# EAGLE design final_board (EAGLE 5.11)

## Sheet 1 of 4
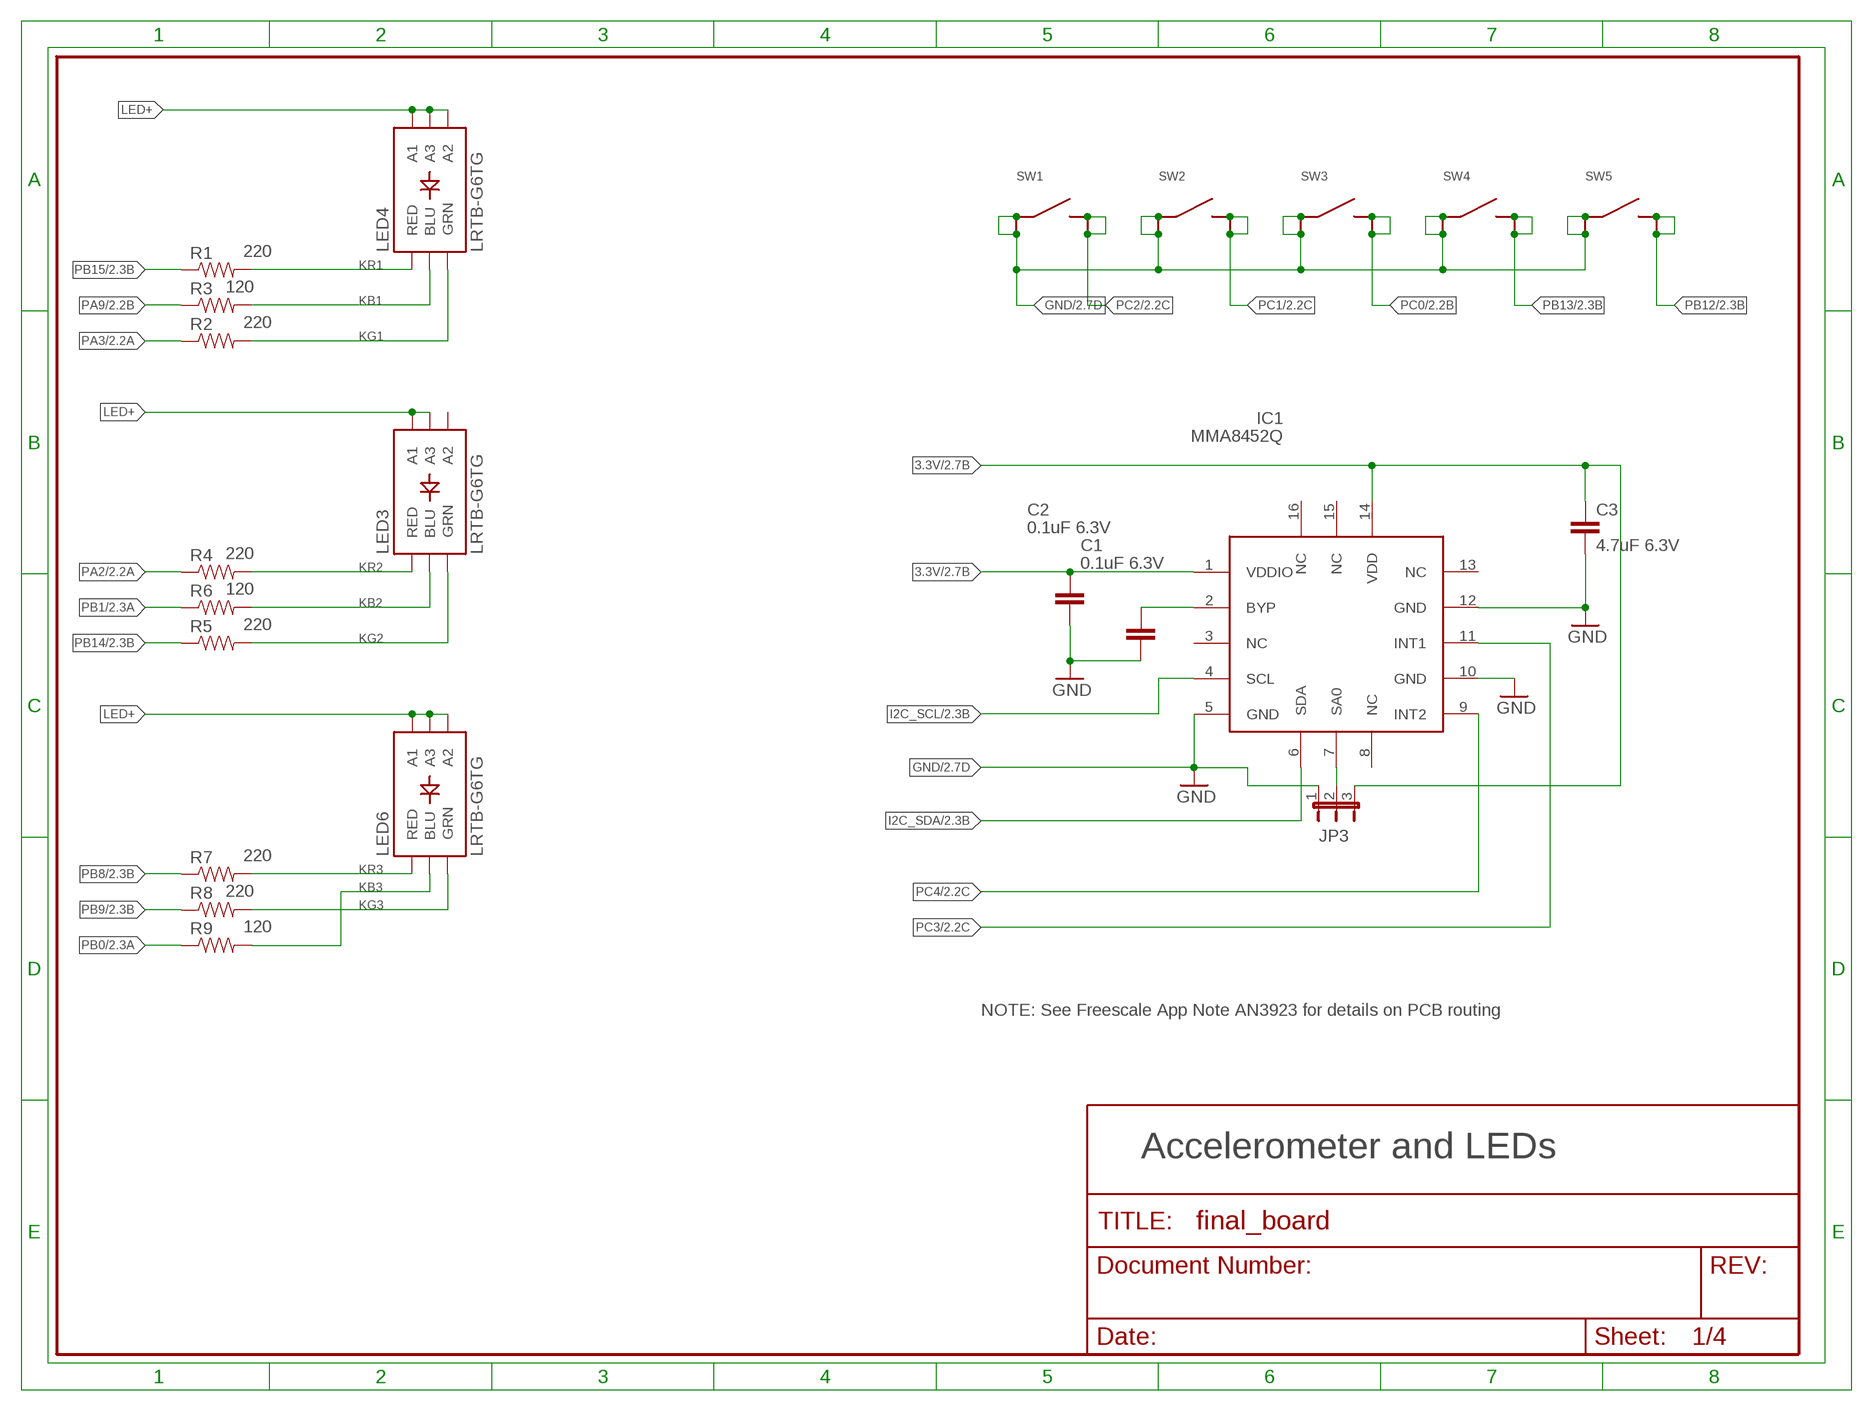
[diagram p0: schematic, sheet 1]

### Parts
C1  0.1uF 6.3V  C-EUC0603  [C0603]
C2  0.1uF 6.3V  C-EUC0603  [C0603]
C3  4.7uF 6.3V  C-EUC0603  [C0603]
IC1  MMA8452Q  [MMA8450Q]
JP3  JUMPER-3SMD  [SJ_3]
LED3  LRTB-G6TG  [LRTB-G6TG]
LED4  LRTB-G6TG  [LRTB-G6TG]
LED6  LRTB-G6TG  [LRTB-G6TG]
R1  220  RESISTOR0603-RES  [0603-RES]
R2  220  RESISTOR0603-RES  [0603-RES]
R3  120  RESISTOR0603-RES  [0603-RES]
R4  220  RESISTOR0603-RES  [0603-RES]
R5  220  RESISTOR0603-RES  [0603-RES]
R6  120  RESISTOR0603-RES  [0603-RES]
R7  220  RESISTOR0603-RES  [0603-RES]
R8  220  RESISTOR0603-RES  [0603-RES]
R9  120  RESISTOR0603-RES  [0603-RES]
SW1  D6_PB  [D6_BUTTON]
SW2  D6_PB  [D6_BUTTON]
SW3  D6_PB  [D6_BUTTON]
SW4  D6_PB  [D6_BUTTON]
SW5  D6_PB  [D6_BUTTON]

### Nets
3.3V: C2.1 C3.1 IC1.1(VDDIO) IC1.14(VDD) JP3.3 ; also sheet 2,3,4
GND: C1.2 C2.2 C3.2 IC1.5(GND) IC1.10(GND) IC1.12(GND) JP3.1 SW1.A1(A) SW1.A2(A1) SW2.A1(A) SW2.A2(A1) SW3.A1(A) SW3.A2(A1) SW4.A1(A) SW4.A2(A1) SW5.A1(A) SW5.A2(A1) ; also sheet 2,3,4
I2C_SCL: IC1.4(SCL) ; also sheet 2
I2C_SDA: IC1.6(SDA) ; also sheet 2
KB1 [LED]: LED4.C3(BLU) R3.2
KB2 [LED]: LED3.C3(BLU) R6.2
KB3 [LED]: LED6.C3(BLU) R9.2
KG1 [LED]: LED4.C2(GRN) R2.2
KG2 [LED]: LED3.C2(GRN) R5.2
KG3 [LED]: LED6.C2(GRN) R8.2
KR1 [LED]: LED4.C1(RED) R1.2
KR2 [LED]: LED3.C1(RED) R4.2
KR3 [LED]: LED6.C1(RED) R7.2
LED+ [LED]: LED3.A1 LED3.A3 LED4.A1 LED4.A2 LED4.A3 LED6.A1 LED6.A2 LED6.A3
N$2: IC1.7(SA0) JP3.2
N$4: C1.1 IC1.2(BYP)
PA2: R4.1 ; also sheet 2
PA3: R2.1 ; also sheet 2
PA9: R3.1 ; also sheet 2
PB0: R9.1 ; also sheet 2
PB1: R6.1 ; also sheet 2
PB8: R7.1 ; also sheet 2
PB9: R8.1 ; also sheet 2
PB12: SW5.B1(B) SW5.B2(B1) ; also sheet 2
PB13: SW4.B1(B) SW4.B2(B1) ; also sheet 2
PB14: R5.1 ; also sheet 2
PB15: R1.1 ; also sheet 2
PC0: SW3.B1(B) SW3.B2(B1) ; also sheet 2
PC1: SW2.B1(B) SW2.B2(B1) ; also sheet 2
PC2: SW1.B1(B) SW1.B2(B1) ; also sheet 2
PC3: IC1.11(INT1) ; also sheet 2
PC4: IC1.9(INT2) ; also sheet 2
Unconnected: IC1.3(NC) IC1.8(NC) IC1.13(NC) IC1.15(NC) IC1.16(NC) LED3.A2

### Notes on the sheet
- NOTE: See Freescale App Note AN3923 for details on PCB routing
- Accelerometer and LEDs

## Sheet 2 of 4
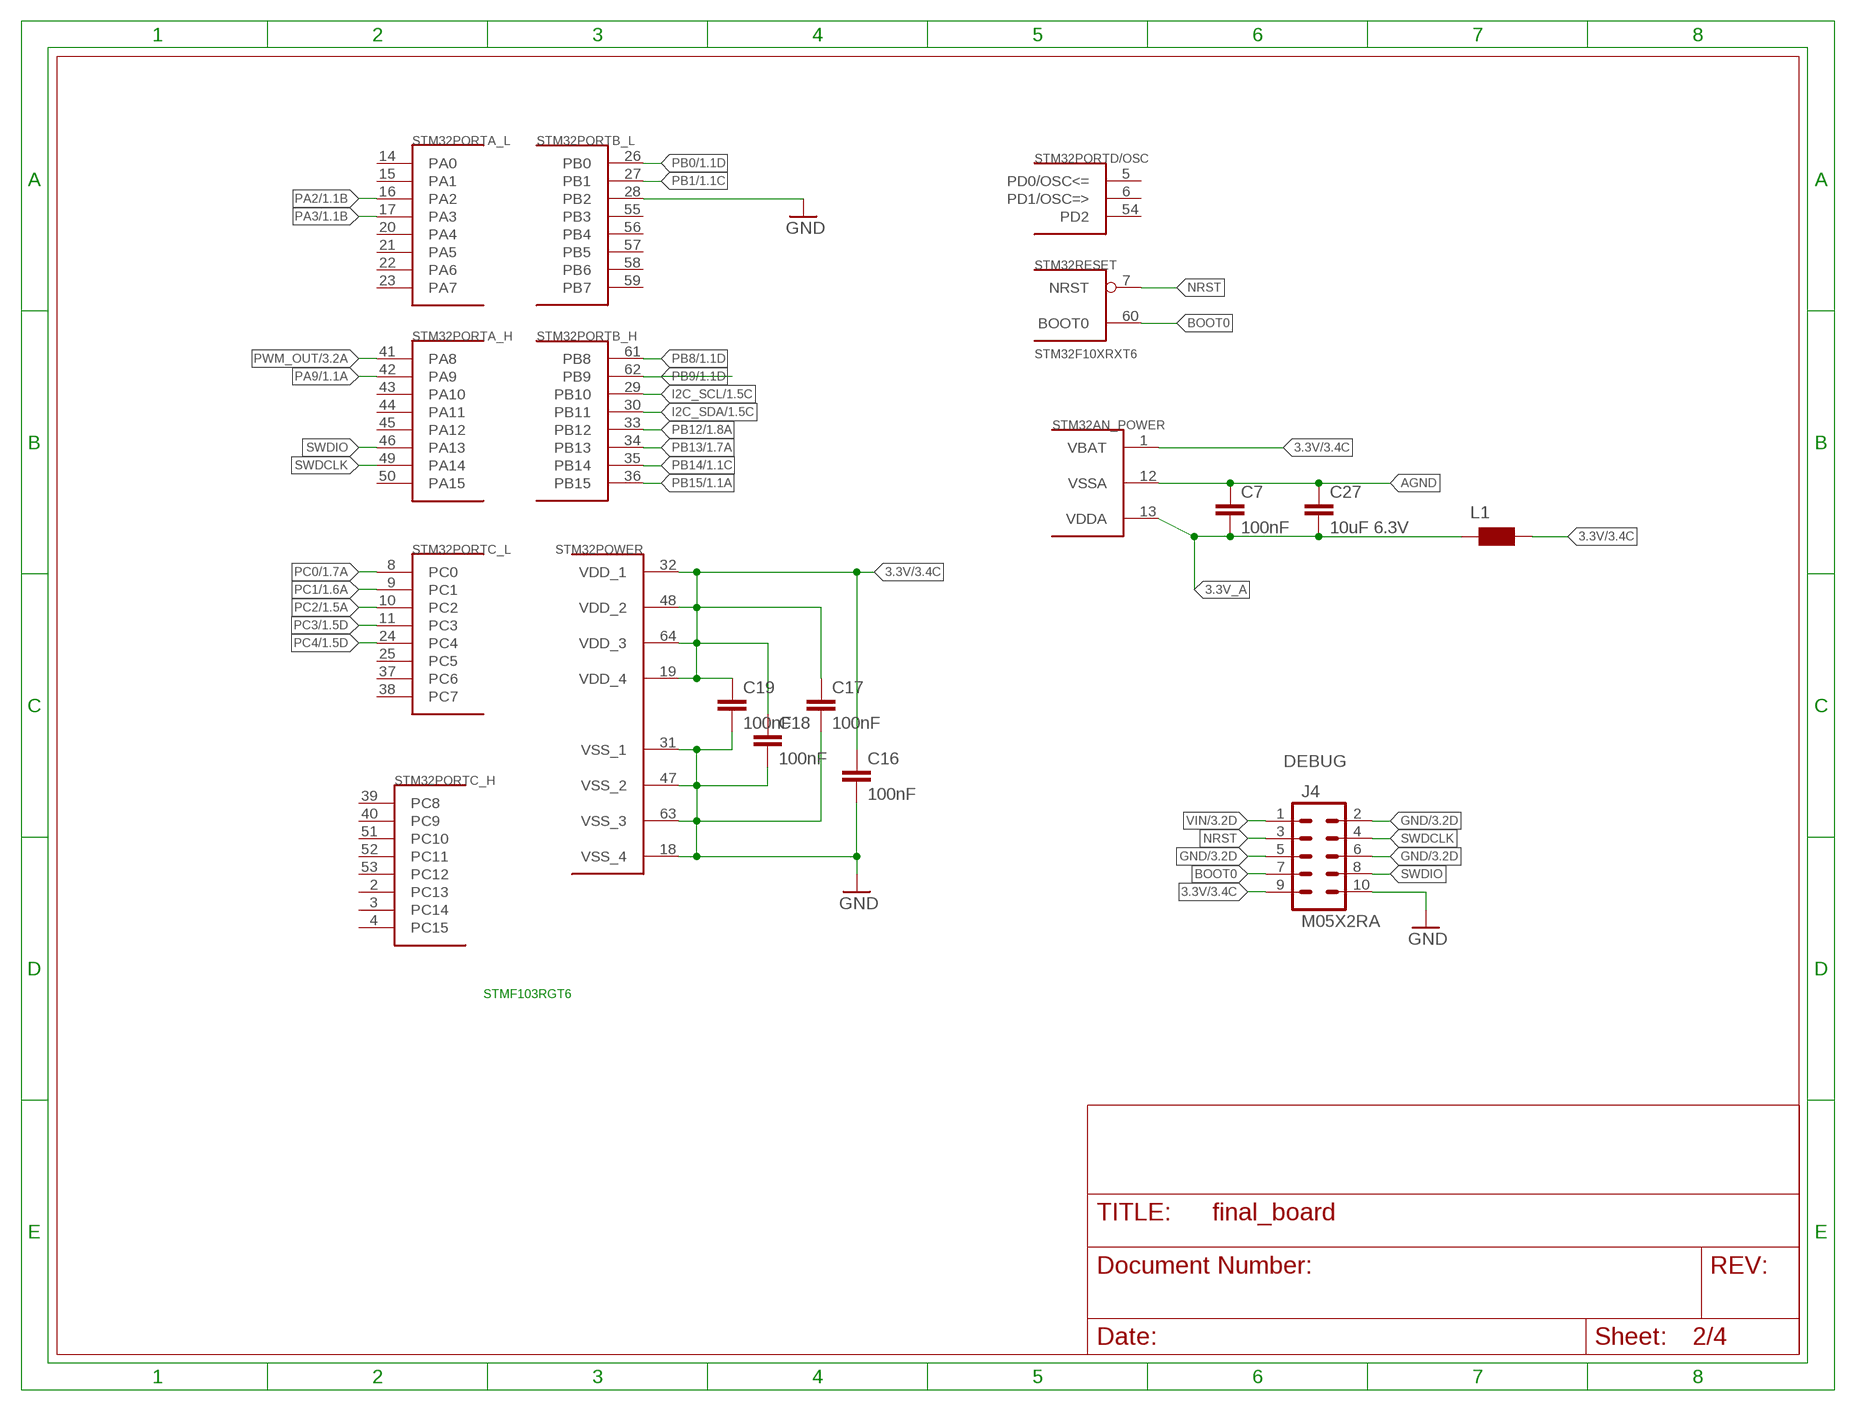
[diagram p1: schematic, sheet 2]

### Parts
C7  100nF  CAP0603-CAP  [0603-CAP]
C16  100nF  CAP0603-CAP  [0603-CAP]
C17  100nF  CAP0603-CAP  [0603-CAP]
C18  100nF  CAP0603-CAP  [0603-CAP]
C19  100nF  CAP0603-CAP  [0603-CAP]
C27  10uF 6.3V  CAP0603-CAP  [0603-CAP]
J4  M05X2RA  [2X5-RA]
L1  WE-CBF_0805  [0805]
STM32  STM32F10XRXT6  [TQFP64]

### Nets
3.3V: C16.1 C17.1 C18.1 C19.1 J4.9 L1.2 STM32.1(AN_POWER:VBAT) STM32.19(POWER:VDD_4) STM32.32(POWER:VDD_1) STM32.48(POWER:VDD_2) STM32.64(POWER:VDD_3) ; also sheet 1,3,4
3.3V_A: C7.2 C27.2 L1.1 STM32.13(AN_POWER:VDDA)
AGND: C7.1 C27.1 STM32.12(AN_POWER:VSSA) ; also sheet 3
BOOT0: J4.7 STM32.60(RESET:BOOT0)
GND: C16.2 C17.2 C18.2 C19.2 J4.2 J4.5 J4.6 J4.10 STM32.18(POWER:VSS_4) STM32.28(PORTB_L:PB2) STM32.31(POWER:VSS_1) STM32.47(POWER:VSS_2) STM32.63(POWER:VSS_3) ; also sheet 1,3,4
I2C_SCL: STM32.29(PORTB_H:PB10) ; also sheet 1
I2C_SDA: STM32.30(PORTB_H:PB11) ; also sheet 1
NRST: J4.3 STM32.7(RESET:NRST)
PA2: STM32.16(PORTA_L:PA2) ; also sheet 1
PA3: STM32.17(PORTA_L:PA3) ; also sheet 1
PA9: STM32.42(PORTA_H:PA9) ; also sheet 1
PB0: STM32.26(PORTB_L:PB0) ; also sheet 1
PB1: STM32.27(PORTB_L:PB1) ; also sheet 1
PB8: STM32.61(PORTB_H:PB8) ; also sheet 1
PB9: STM32.62(PORTB_H:PB9) ; also sheet 1
PB12: STM32.33(PORTB_H:PB12) ; also sheet 1
PB13: STM32.34(PORTB_H:PB13) ; also sheet 1
PB14: STM32.35(PORTB_H:PB14) ; also sheet 1
PB15: STM32.36(PORTB_H:PB15) ; also sheet 1
PC0: STM32.8(PORTC_L:PC0) ; also sheet 1
PC1: STM32.9(PORTC_L:PC1) ; also sheet 1
PC2: STM32.10(PORTC_L:PC2) ; also sheet 1
PC3: STM32.11(PORTC_L:PC3) ; also sheet 1
PC4: STM32.24(PORTC_L:PC4) ; also sheet 1
PWM_OUT: STM32.41(PORTA_H:PA8) ; also sheet 3
SWDCLK: J4.4 STM32.49(PORTA_H:PA14)
SWDIO: J4.8 STM32.46(PORTA_H:PA13)
VIN: J4.1 ; also sheet 3
Unconnected: STM32.2(PORTC_H:PC13) STM32.3(PORTC_H:PC14) STM32.4(PORTC_H:PC15) STM32.5(PORTD/OSC:PD0/OSC<=) STM32.6(PORTD/OSC:PD1/OSC=>) STM32.14(PORTA_L:PA0) STM32.15(PORTA_L:PA1) STM32.20(PORTA_L:PA4) STM32.21(PORTA_L:PA5) STM32.22(PORTA_L:PA6) STM32.23(PORTA_L:PA7) STM32.25(PORTC_L:PC5) STM32.37(PORTC_L:PC6) STM32.38(PORTC_L:PC7) STM32.39(PORTC_H:PC8) STM32.40(PORTC_H:PC9) STM32.43(PORTA_H:PA10) STM32.44(PORTA_H:PA11) STM32.45(PORTA_H:PA12) STM32.50(PORTA_H:PA15) STM32.51(PORTC_H:PC10) STM32.52(PORTC_H:PC11) STM32.53(PORTC_H:PC12) STM32.54(PORTD/OSC:PD2) STM32.55(PORTB_L:PB3) STM32.56(PORTB_L:PB4) STM32.57(PORTB_L:PB5) STM32.58(PORTB_L:PB6) STM32.59(PORTB_L:PB7)

### Notes on the sheet
- DEBUG
- STMF103RGT6

## Sheet 3 of 4
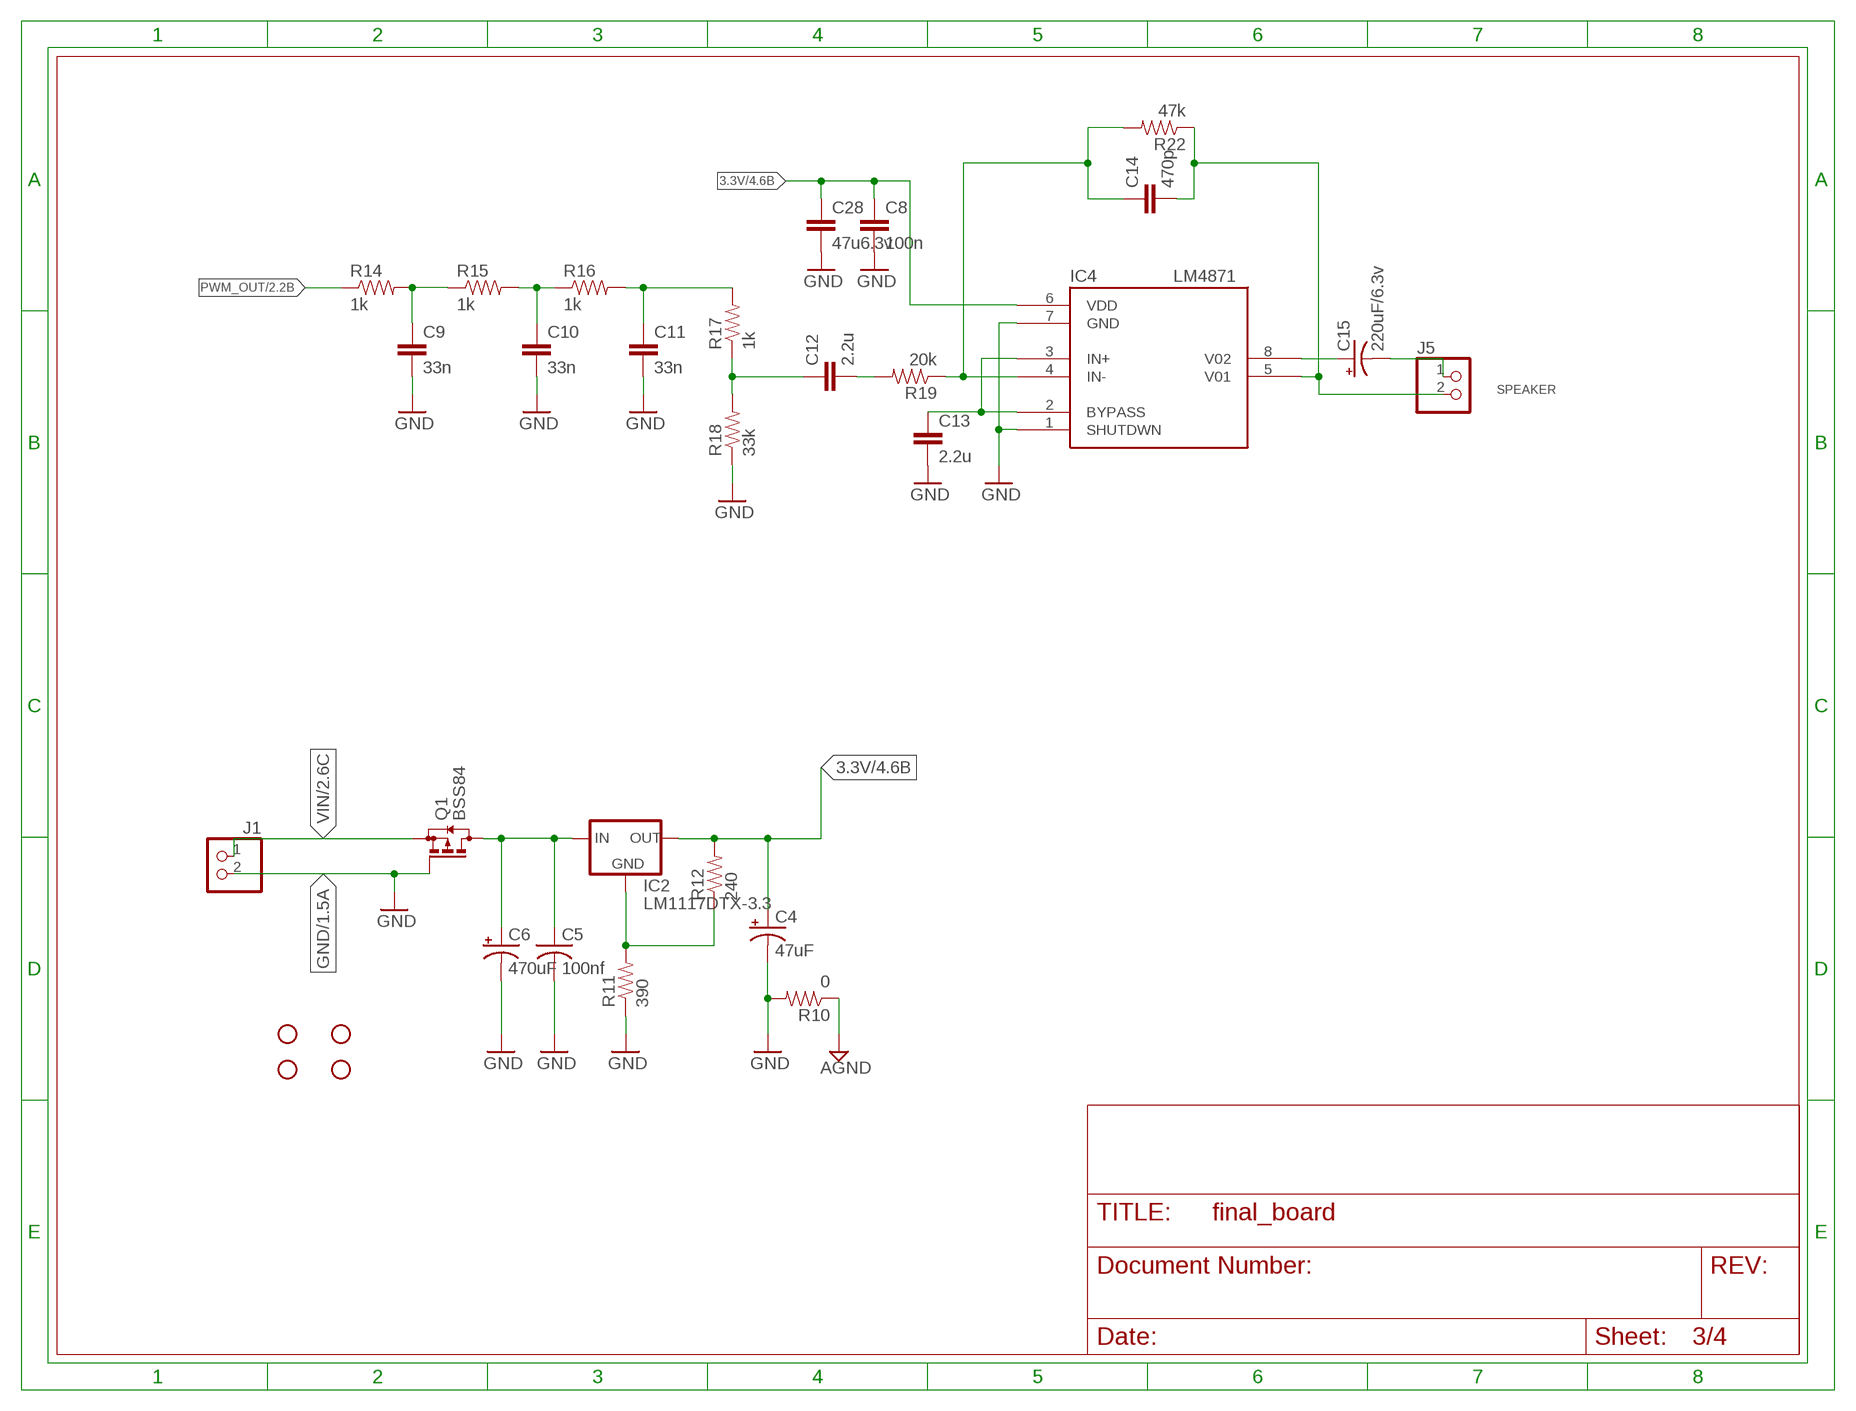
[diagram p2: schematic, sheet 3]

### Parts
C4  47uF  CAP_POLC  [PANASONIC_C]
C5  100nf  C-USC0603  [C0603]
C6  470uF  CAP_POLE  [PANASONIC_E]
C8  100n  CAP0402-CAP  [0402-CAP]
C9  33n  CAP0402-CAP  [0402-CAP]
C10  33n  CAP0402-CAP  [0402-CAP]
C11  33n  CAP0402-CAP  [0402-CAP]
C12  2.2u  CAP0402-CAP  [0402-CAP]
C13  2.2u  CAP0402-CAP  [0402-CAP]
C14  470p  CAP0402-CAP  [0402-CAP]
C15  220uF/6.3v  CAP_POLE  [PANASONIC_E]
C28  47u6.3v  CAP0402-CAP  [0402-CAP]
IC2  LM1117DTX-3.3  [TO252]
IC4  LM4871  [SO08]
J1  PINHD-1X2  [1X02]
J5  PINHD-1X2  [1X02]
JP4  STAND-OFF  [STAND-OFF]
JP5  STAND-OFF  [STAND-OFF]
JP6  STAND-OFF  [STAND-OFF]
JP11  STAND-OFF  [STAND-OFF]
Q1  BSS84  [SOT23]
R10  0  RESISTOR0603-RES  [0603-RES]
R11  390  RESISTOR0603-RES  [0603-RES]
R12  240  RESISTOR0603-RES  [0603-RES]
R14  1k  RESISTOR0603-RES  [0603-RES]
R15  1k  RESISTOR0603-RES  [0603-RES]
R16  1k  RESISTOR0603-RES  [0603-RES]
R17  1k  RESISTOR0603-RES  [0603-RES]
R18  33k  RESISTOR0603-RES  [0603-RES]
R19  20k  RESISTOR0603-RES  [0603-RES]
R22  47k  RESISTOR0603-RES  [0603-RES]

### Nets
3.3V: C4.+ C8.1 C28.1 IC2.TAB(OUT) IC4.6(VDD) R12.2 ; also sheet 1,2,4
AGND: R10.1 ; also sheet 2
GND: C4.- C5.2 C6.- C8.2 C9.2 C10.2 C11.2 C13.2 C28.2 IC4.1(SHUTDWN) IC4.7(GND) J1.2 Q1.1(G) R10.2 R11.1 R18.1 ; also sheet 1,2,4
N$1: IC2.1(GND) R11.2 R12.1
N$3: C9.1 R14.2 R15.1
N$6: C10.1 R15.2 R16.1
N$17: C11.1 R16.2 R17.2
N$18: C13.1 IC4.2(BYPASS) IC4.3(IN+)
N$23: C12.1 R17.1 R18.2
N$25: C12.2 R19.2
N$28: C14.1 IC4.4(IN-) R19.1 R22.2
N$12312: C15.+ IC4.8(V02)
PWM_OUT: R14.1 ; also sheet 2
SPK1: C14.2 IC4.5(V01) J5.2 R22.1
SPK2: C15.- J5.1
VIN: J1.1 Q1.2(S) ; also sheet 2
VIN_SW: C5.1 C6.+ IC2.2(IN) Q1.3(D)

### Notes on the sheet
- SPEAKER

## Sheet 4 of 4
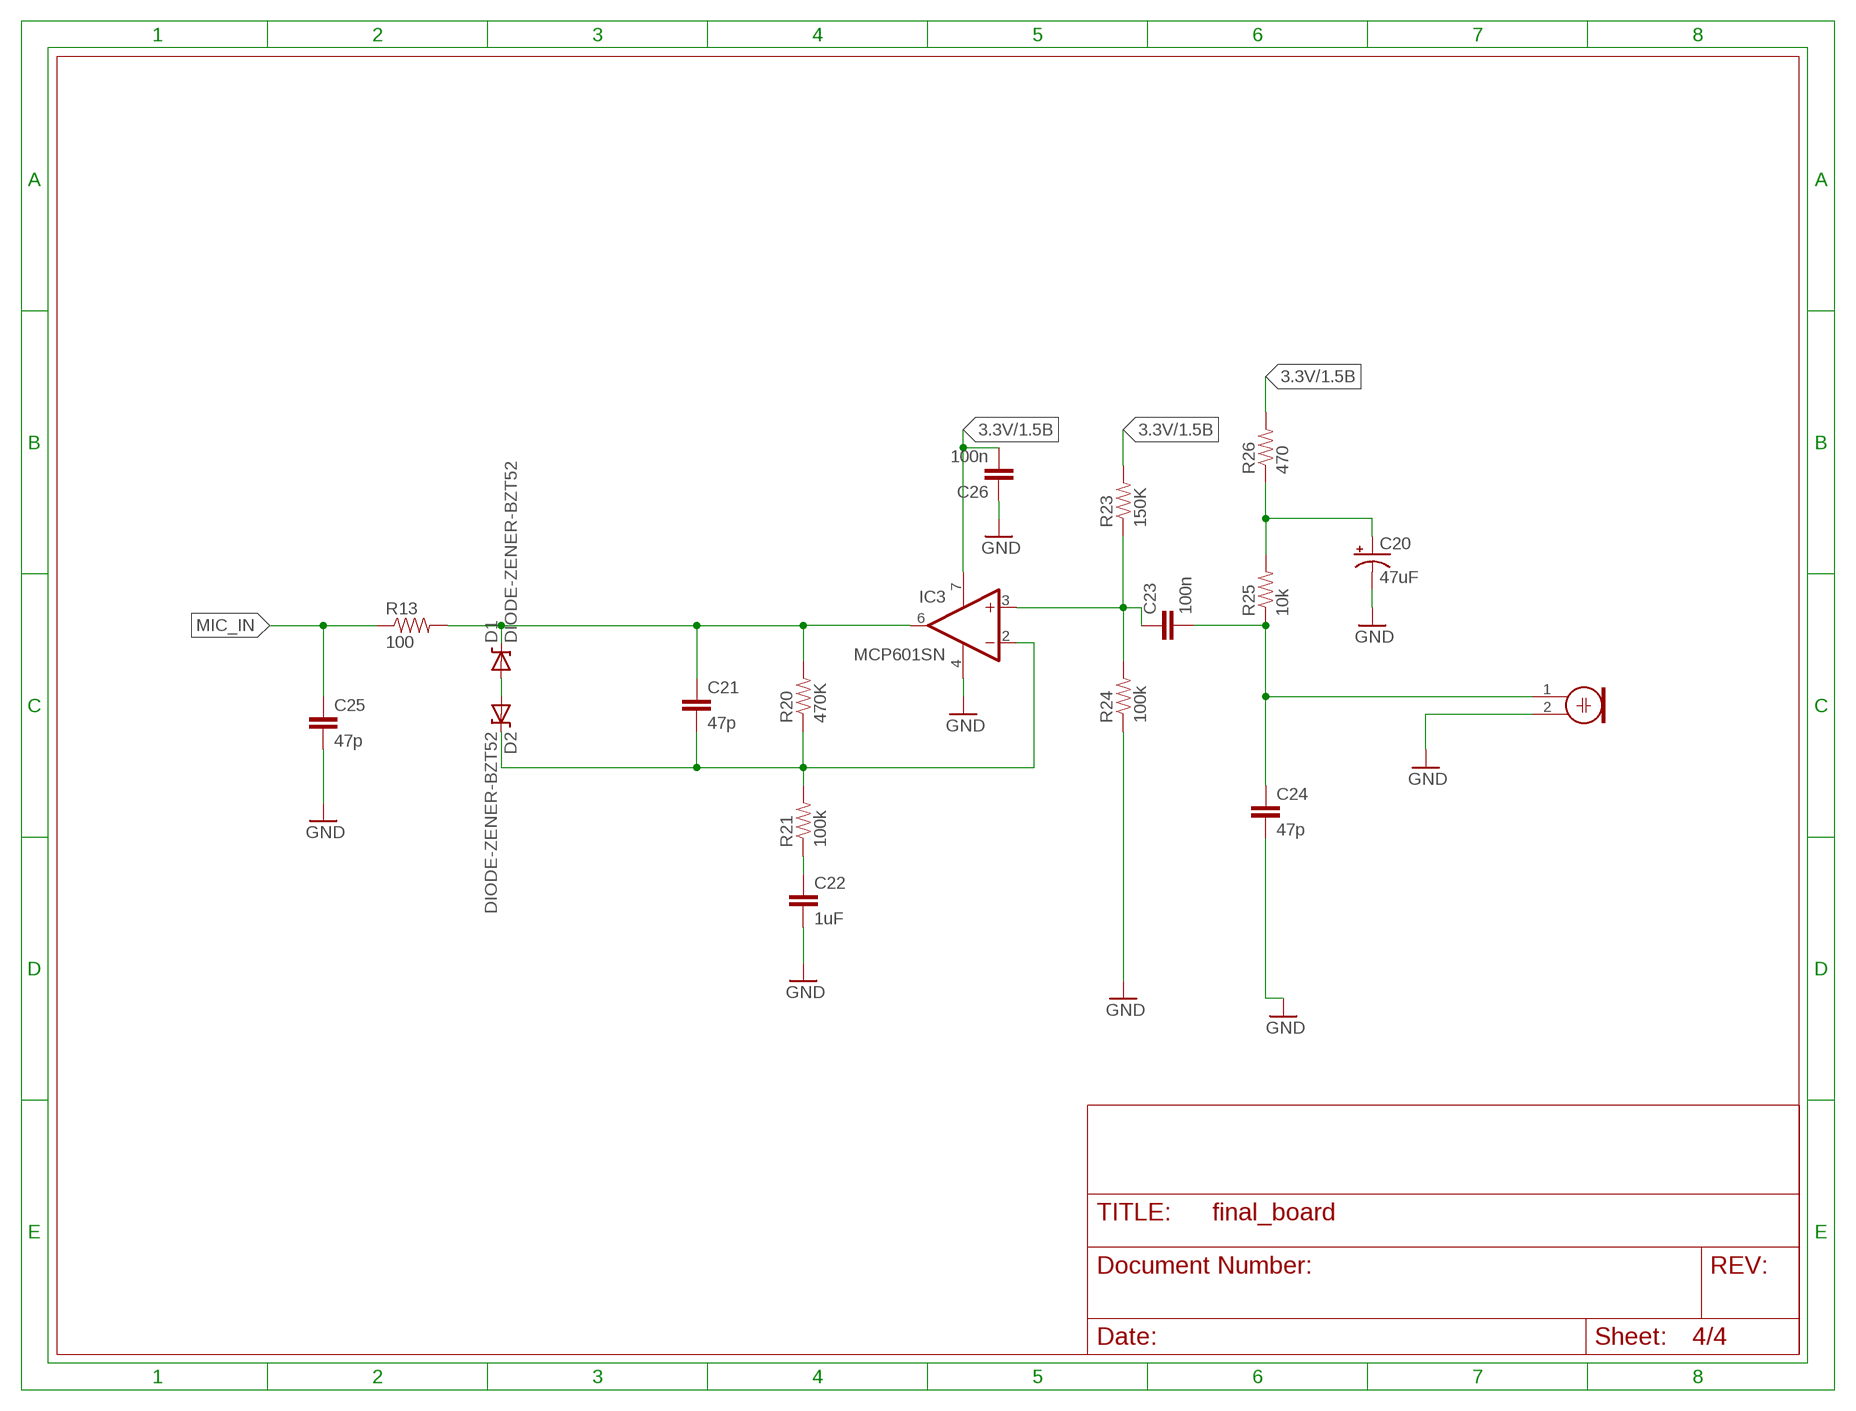
[diagram p3: schematic, sheet 4]

### Parts
C20  47uF  CAP_POLC  [PANASONIC_C]
C21  47p  CAP0603-CAP  [0603-CAP]
C22  1uF  CAP0402-CAP  [0402-CAP]
C23  100n  CAP0603-CAP  [0603-CAP]
C24  47p  CAP0603-CAP  [0603-CAP]
C25  47p  CAP0603-CAP  [0603-CAP]
C26  100n  CAP0603-CAP  [0603-CAP]
D1  DIODE-ZENER-BZT52  [SOD-323]
D2  DIODE-ZENER-BZT52  [SOD-323]
IC3  MCP601SN  [SO08]
M1  ELECTRET_MICROPHON-WM-61A  [WM-61A]
R13  100  RESISTOR0603-RES  [0603-RES]
R20  470K  RESISTOR0603-RES  [0603-RES]
R21  100k  RESISTOR0603-RES  [0603-RES]
R23  150K  RESISTOR0603-RES  [0603-RES]
R24  100k  RESISTOR0603-RES  [0603-RES]
R25  10k  RESISTOR0603-RES  [0603-RES]
R26  470  RESISTOR0603-RES  [0603-RES]

### Nets
3.3V: C26.2 IC3.7(V+) R23.2 R26.2 ; also sheet 1,2,3
D1: D1.2(A) D2.2(A)
GND: C20.- C22.2 C24.2 C25.2 C26.1 IC3.4(V-) M1.2 R24.1 ; also sheet 1,2,3
MIC_IN: C25.1 R13.1
N$5: C21.1 D1.1(C) IC3.6(OUT) R13.2 R20.2
N$8: C21.2 D2.1(C) IC3.2(-IN) R20.1 R21.2
N$9: C22.1 R21.1
N$10: C23.1 IC3.3(+IN) R23.1 R24.2
N$11: C23.2 C24.1 M1.1 R25.1
N$12: C20.+ R25.2 R26.1

## Library data of the parts
C1-C3 = rcl:C-EU: CAPACITOR, European symbol
C4 C6 = gghc:CAP_POL: Capacitor Polarized These are standard SMD and PTH capacitors. Normally 10uF, 47uF, and 100uF in electrolytic and tantalum varieties. Always verify the external diameter of the through hole cap, it varies with capacity, voltage, and manufacturer. The EIA devices should be standard.
C5 = resistor:C-US: CAPACITOR, American symbol
C7 C27 = gghc:CAP: Capacitor Standard 0603 ceramic capacitor, and 0.1" leaded capacitor.
C8-C14 C16-C19 C21-C26 C28 = SparkFun:CAP: Capacitor Standard 0603 ceramic capacitor, and 0.1" leaded capacitor.
C15 C20 = SparkFun:CAP_POL: Capacitor Polarized These are standard SMD and PTH capacitors. Normally 10uF, 47uF, and 100uF in electrolytic and tantalum varieties. Always verify the external diameter of the through hole cap, it varies with capacity, voltage, and manufacturer. The EIA devices should be standard.
D1 D2 = SparkFun:DIODE-ZENER: Zener Diode Production Part - 8199 3.4V Zener Voltage
IC1 = gghc:MMA8452Q
IC2 = lm1117:LM1117DTX-*
IC3 = linear:MCP601: Single Op Amp 2.7V to 6.0V Single Supply CMOS Source: http://ww1.microchip.com/downloads/en/DeviceDoc/21314g.pdf
IC4 = gghc:LM4871
J1 J5 = pinhead:PINHD-1X2: PIN HEADER
J4 = gghc:M05X2: Header 5x2 Standard 10-pin dual row 0.1" header. Commonly used with AVR-ISP. Use with Spark Fun Electronics SKU: PRT-00778
JP3 = SparkFun:JUMPER-3
JP4-JP6 JP11 = SparkFun:STAND-OFF: Stand Off This is the mechanical footprint for a #4 phillips button head screw. Use the keepout ring to avoid running the screw head into surrounding components. SKU : PRT-00447
L1 = wuerth-elektronik:WE-CBF: SMD EMI Suppression Ferrite Beads - excellent anti-EMI properties - low DCR - impedances till 3000 ohms - rated current up to 6 A
LED3 LED4 LED6 = gghc:LRTB-G6TG
M1 = microphon:ELECTRET_MICROPHON-: Electret Condenser Microphone
Q1 = transistor-small-signal:BSS84: P-CHANNEL MOS FET
R1-R26 = SparkFun:RESISTOR: Resistor Basic schematic elements and footprints for 0603, 1206, and PTH resistors.
STM32 = gghc:STM32F10XRXT6: STM32F101/103 64pin LQFP
SW1-SW5 = gghc:D6_PB

## Net classes
0 default: width 0.254 mm
1 LED: width 0.61 mm

## Board
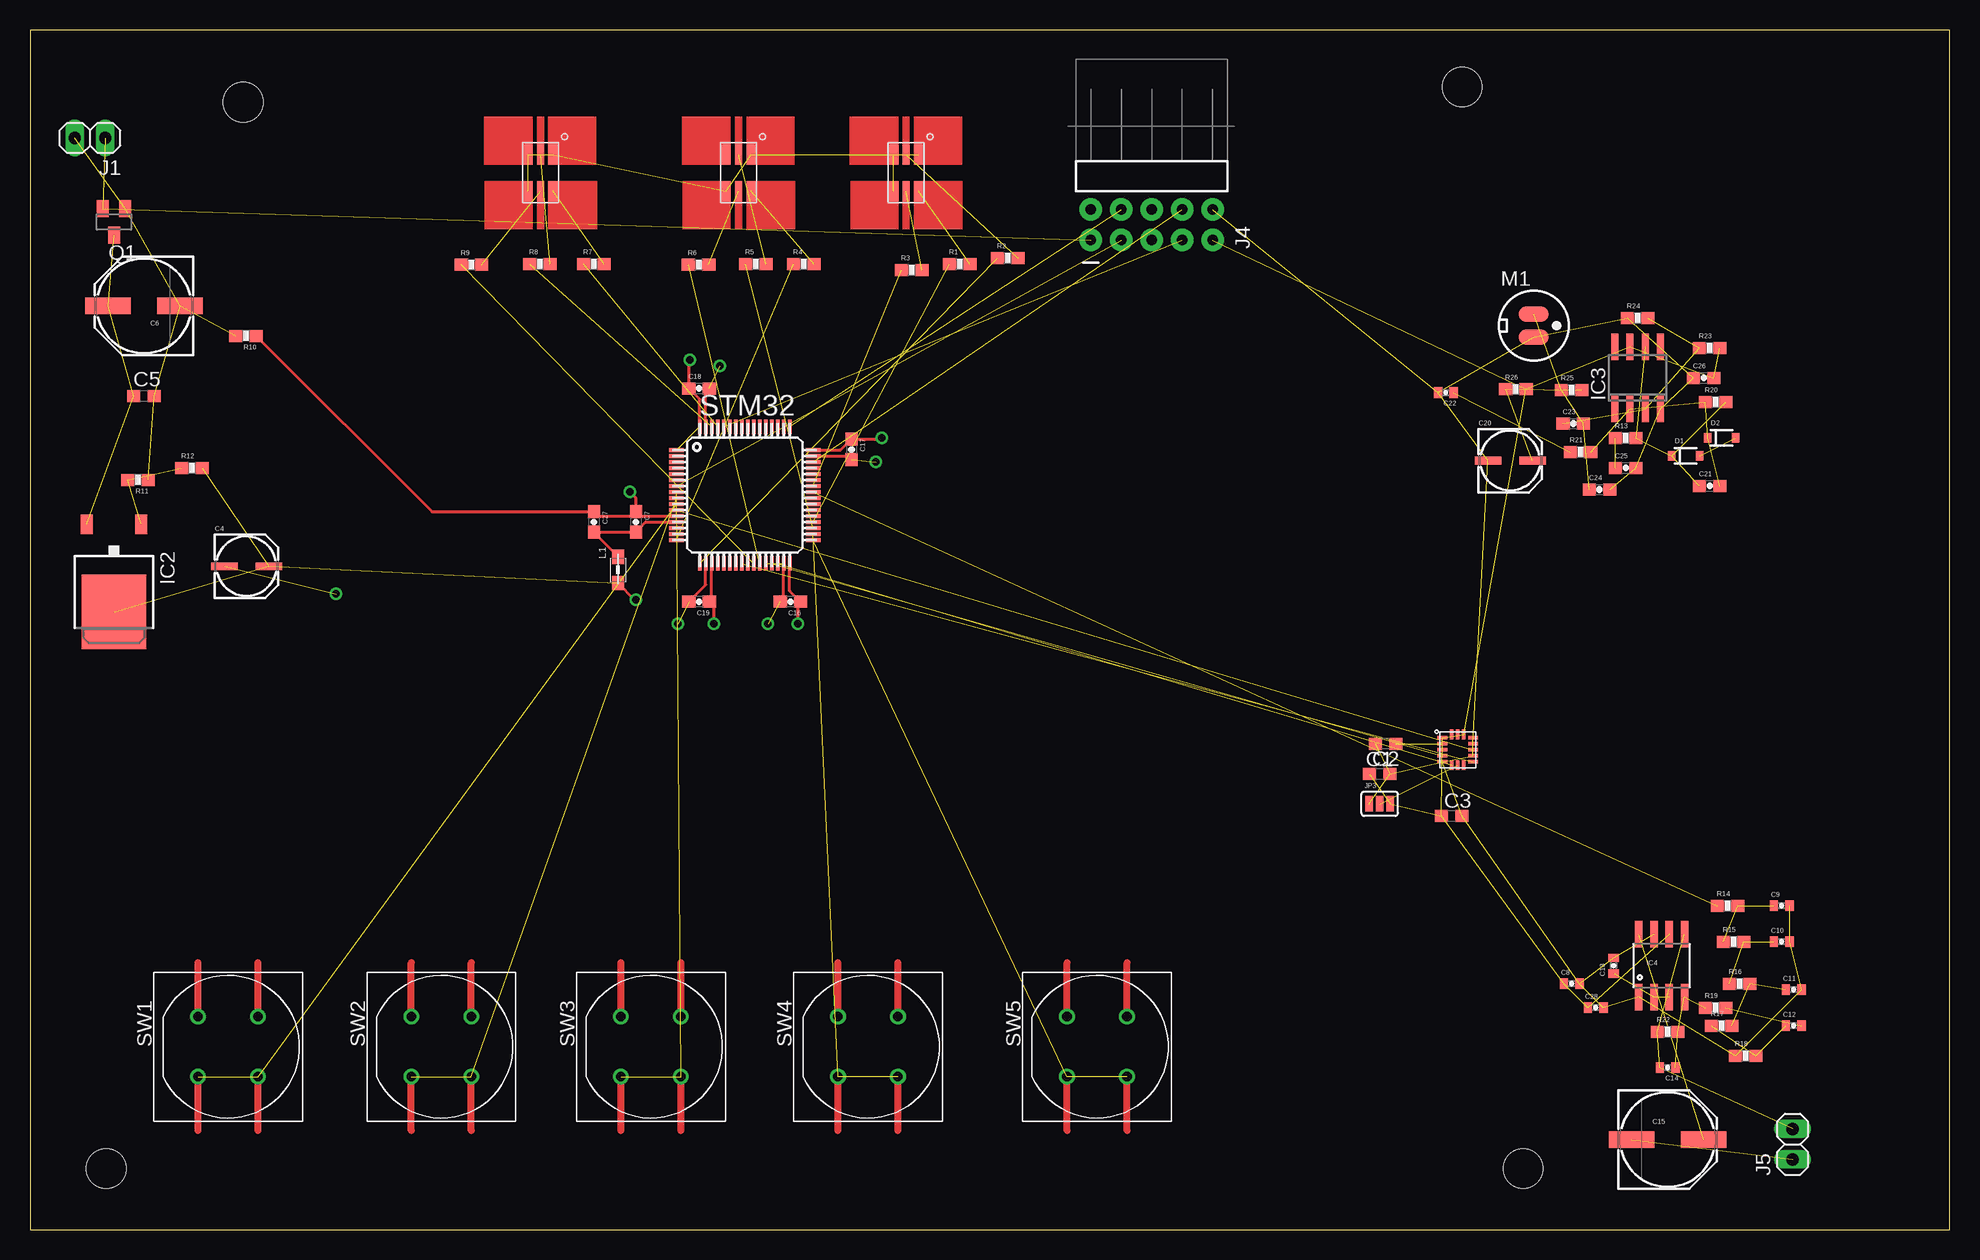
[diagram p4: board, top side]
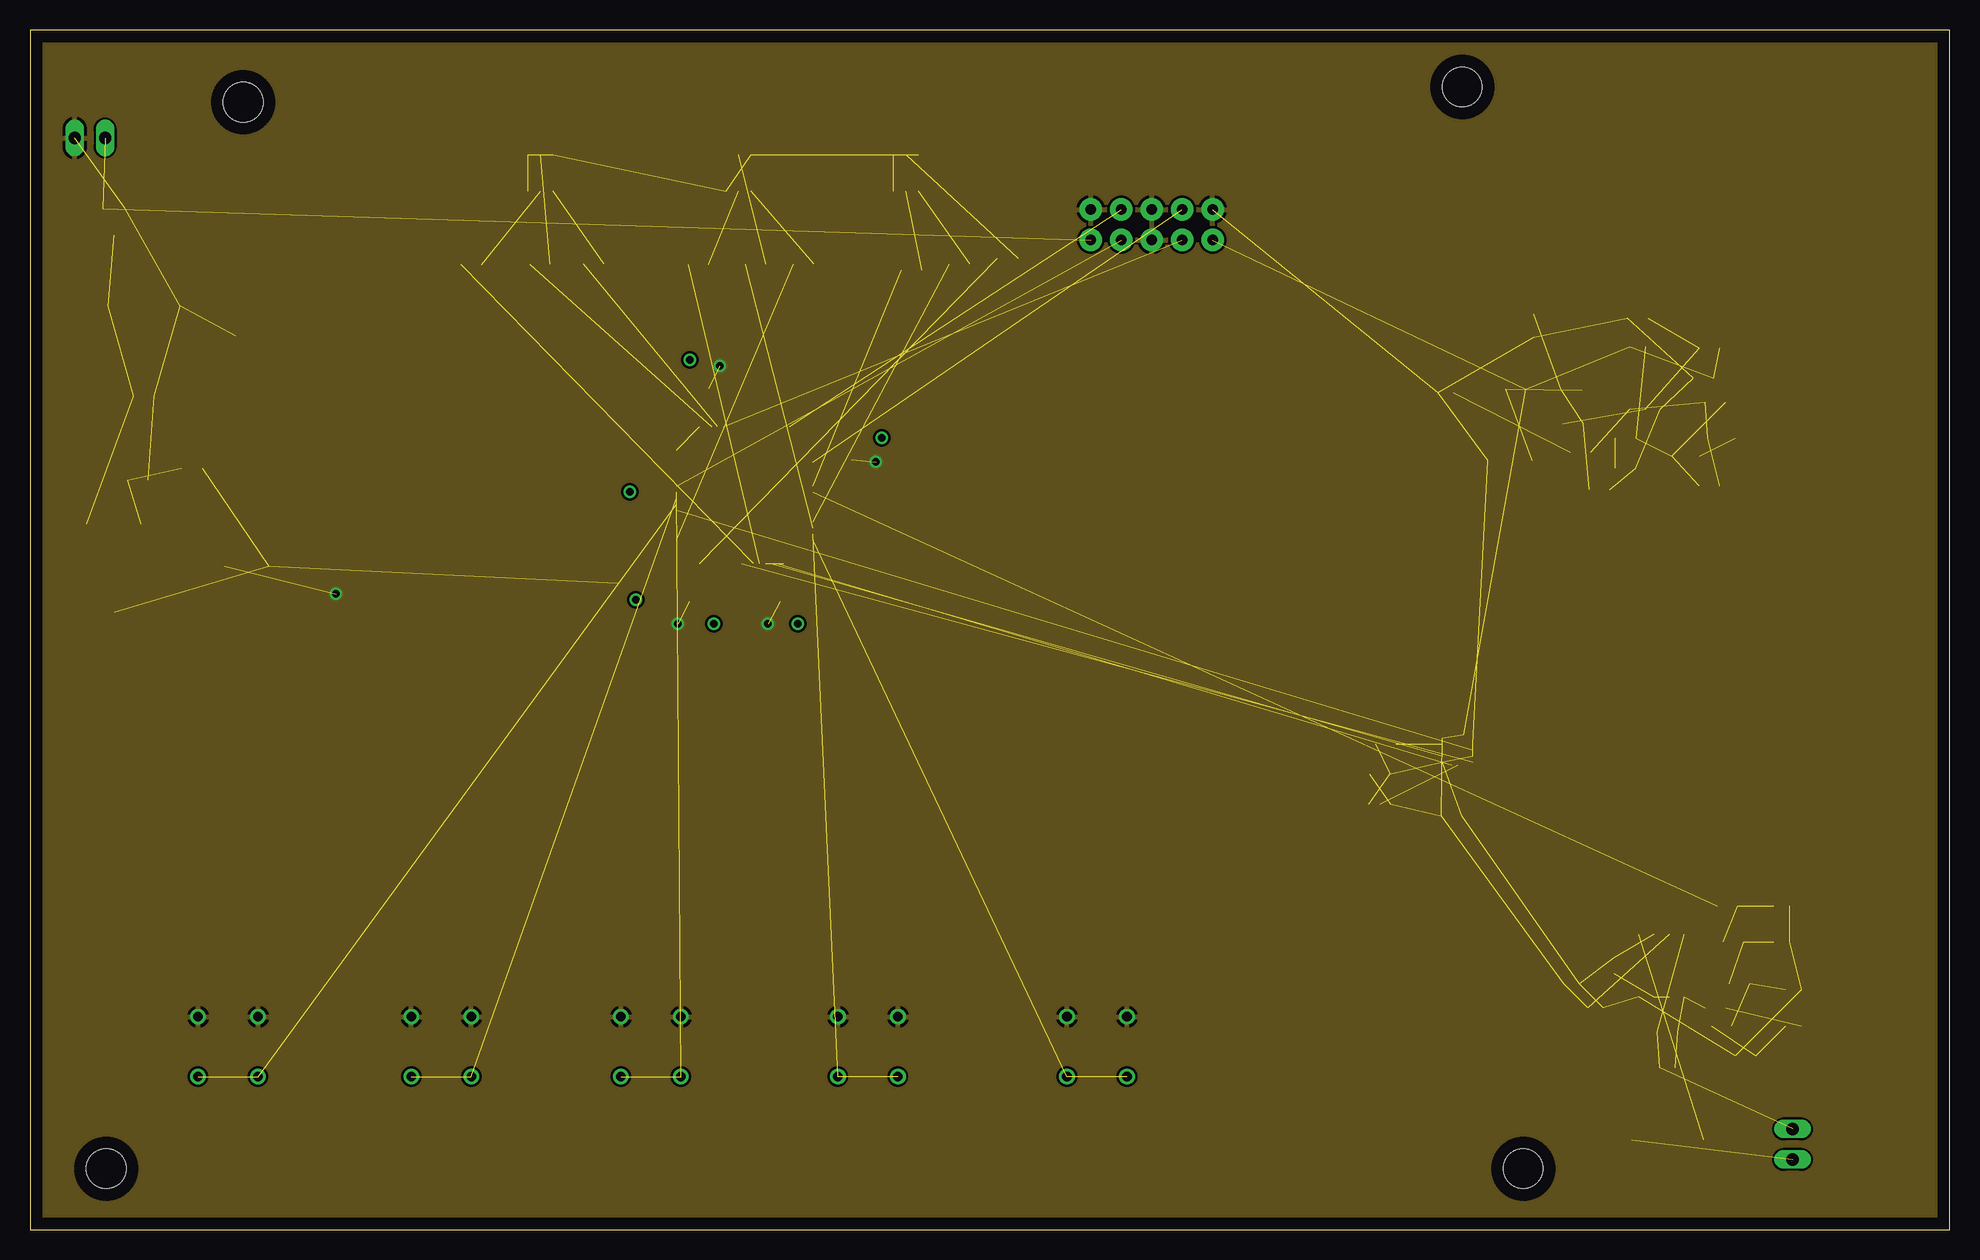
[diagram p5: board, inner layer Route2]
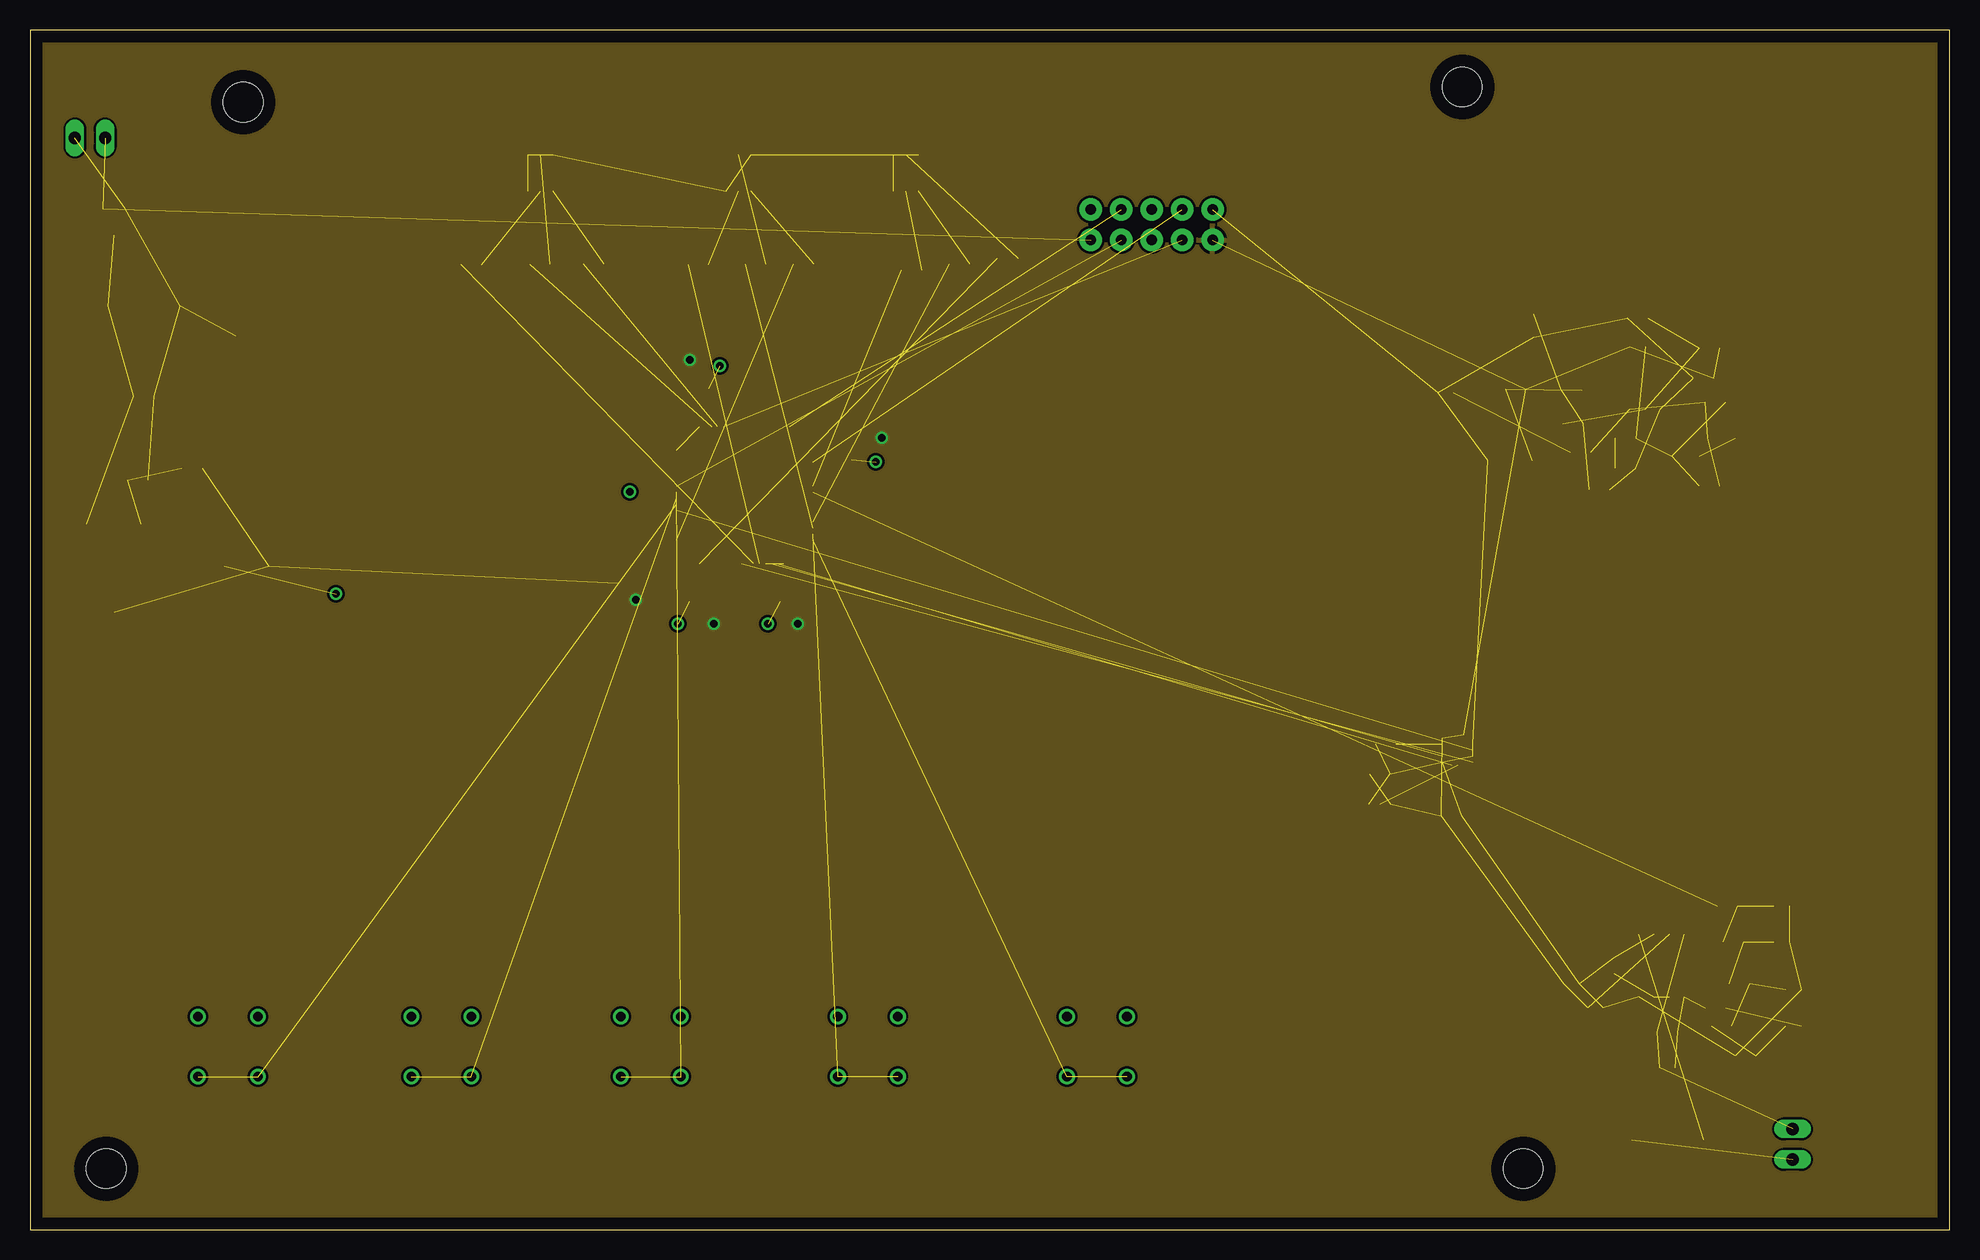
[diagram p6: board, inner layer Route15]

Size 160 x 100 mm. Coordinates in mm from the lower left corner, seen from the top.
Outline: 0,0 160,0 160,100 0,100 0,0
Copper layers (1*2+15*16): Top 0.035mm / dielectric 1.5mm / Route2 0.035mm / dielectric 0.15mm / Route15 0.035mm / dielectric 0.2mm / Bottom 0.035mm
Design rules "default *": minimum track width 10mil, minimum drill 24mil, track to track 8mil, track to pad 8mil, pad to pad 8mil, via to via 8mil, smd to smd 8mil, copper to edge 40mil, drill to drill 8mil, minimum pad ring 10mil, minimum via ring 8mil, stop-mask expansion 4mil, vias tented up to drill 0mil, thermal gap 10mil

### Footprints (pad centres in the part's own frame; a part is rotated, then mirrored left to right if it is on the bottom)
C0603 = smd 1.1 x 1: 1 -0.85,0; 2 0.85,0
PANASONIC_C = smd 2.2 x 0.65: + 1.9,-0.2; - -1.8,-0.2
PANASONIC_E = smd 3.8 x 1.4: + 3,0; - -3,0
0603-CAP = smd 1.1 x 1: 1 -0.85,0; 2 0.85,0
0402-CAP = smd 0.7 x 0.9: 1 -0.65,0; 2 0.65,0
SOD-323 = smd 0.63 x 0.83: 1 -1.15,0; 2 1.15,0
MMA8450Q = smd 0.8 x 0.3: 1 -1.275,1; 2 -1.275,0.5; 3 -1.275,0; 4 -1.275,-0.5; 5 -1.275,-1; 9 1.275,-1; 10 1.275,-0.5; 11 1.275,0; 12 1.275,0.5; 13 1.275,1 | smd 0.3 x 0.8: 6 -0.5,-1.275; 7 0,-1.275; 8 0.5,-1.275; 14 0.5,1.275; 15 0,1.275; 16 -0.5,1.275
TO252 = smd 1 x 1.6: 1 -2.28,-4.8; 2 2.28,-4.8 | smd 5.4 x 6.2: TAB 0,2.5
SO08 = smd 0.6 x 2.2: 1 -1.905,-2.6; 2 -0.635,-2.6; 3 0.635,-2.6; 4 1.905,-2.6; 5 1.905,2.6; 6 0.635,2.6; 7 -0.635,2.6; 8 -1.905,2.6
SO08' = smd 0.61 x 2.21: 1 -1.905,-2.616; 2 -0.635,-2.616; 3 0.635,-2.616; 4 1.905,-2.616; 5 1.905,2.616; 6 0.635,2.616; 7 -0.635,2.616; 8 -1.905,2.616
1X02 = drill 1.016 long: 1 -1.27,0; 2 1.27,0
2X5-RA = drill 0.889 pad 1.88 round: 1 -1.27,5.08; 2 1.27,5.08; 3 -1.27,2.54; 4 1.27,2.54; 5 -1.27,0; 6 1.27,0; 7 -1.27,-2.54; 8 1.27,-2.54; 9 -1.27,-5.08; 10 1.27,-5.08
SJ_3 = smd 0.635 x 1.27: 1 -0.889,0; 2 0,0; 3 0.889,0
STAND-OFF = hole 3.302: 0,0
0805 = smd 1.2 x 1: 1 -1.1,0; 2 1.1,0
LRTB-G6TG = smd 0.8 x 1.65: A1 1.05,1.525; A2 -1.05,1.525; A3 -1.05,-1.525; C1 1.05,-1.525 | smd 0.6 x 1.65: C2 0,1.525; C3 0,-1.525
WM-61A = smd 2.5 x 1.3: 1 0,0.95; 2 0,-0.95
SOT23 = smd 1 x 1.4: 1 -0.95,-1.1; 2 0.95,-1.1; 3 0,1.1
0603-RES = smd 1.1 x 1: 1 -0.85,0; 2 0.85,0
TQFP64 = smd 1.2 x 0.3: 1 -5.7,3.75; 2 -5.7,3.25; 3 -5.7,2.75; 4 -5.7,2.25; 5 -5.7,1.75; 6 -5.7,1.25; 7 -5.7,0.75; 8 -5.7,0.25; 9 -5.7,-0.25; 10 -5.7,-0.75; 11 -5.7,-1.25; 12 -5.7,-1.75; 13 -5.7,-2.25; 14 -5.7,-2.75; 15 -5.7,-3.25; 16 -5.7,-3.75; 33 5.7,-3.75; 34 5.7,-3.25; 35 5.7,-2.75; 36 5.7,-2.25; 37 5.7,-1.75; 38 5.7,-1.25; 39 5.7,-0.75; 40 5.7,-0.25; 41 5.7,0.25; 42 5.7,0.75; 43 5.7,1.25; 44 5.7,1.75; 45 5.7,2.25; 46 5.7,2.75; 47 5.7,3.25; 48 5.7,3.75 | smd 0.3 x 1.2: 17 -3.75,-5.7; 18 -3.25,-5.7; 19 -2.75,-5.7; 20 -2.25,-5.7; 21 -1.75,-5.7; 22 -1.25,-5.7; 23 -0.75,-5.7; 24 -0.25,-5.7; 25 0.25,-5.7; 26 0.75,-5.7; 27 1.25,-5.7; 28 1.75,-5.7; 29 2.25,-5.7; 30 2.75,-5.7; 31 3.25,-5.7; 32 3.75,-5.7; 49 3.75,5.7; 50 3.25,5.7; 51 2.75,5.7; 52 2.25,5.7; 53 1.75,5.7; 54 1.25,5.7; 55 0.75,5.7; 56 0.25,5.7; 57 -0.25,5.7; 58 -0.75,5.7; 59 -1.25,5.7; 60 -1.75,5.7; 61 -2.25,5.7; 62 -2.75,5.7; 63 -3.25,5.7; 64 -3.75,5.7
D6_BUTTON = drill 0.8 round: A1 -2.5,2.5; A2 2.5,2.5; B1 -2.5,-2.5; B2 2.5,-2.5

### Placement (x,y rotation side)
C1  113,40.5 180 top
C2  112.5,38 0 top
C3  118.5,34.5 0 top
C4  18,55.5 0 top
C5  9.5,69.5 0 top
C6  9.5,77 180 top
C7  50.5,59 270 top
C8  128.5,20.5 0 top
C9  146,27 0 top
C10  146,24 0 top
C11  147,20 0 top
C12  147,17 0 top
C13  132,22 90 top
C14  136.5,13.5 180 top
C15  136.5,7.5 0 top
C16  63.39,52.34 180 top
C17  68.47,65.04 270 top
C18  55.77,70.12 0 top
C19  55.77,52.34 180 top
C20  123.34,64.3 0 top
C21  140,62 0 top
C22  118.01,69.76 180 top
C23  128.64,67.18 0 top
C24  130.83,61.68 0 top
C25  133,63.5 0 top
C26  139.5,71 0 top
C27  47,59 270 top
C28  130.5,18.5 0 top
D1  138,64.5 0 top
D2  141,66 0 top
IC1  119,40 0 top
IC2  7,54 180 top
IC3  134,71 0 top
IC4  LM4871  [SO08']  136,22 0 top
J1  5,91 180 top
J4  93.5,83.76 90 top
J5  146.92,7.11 90 top
JP3  112.5,35.5 0 top
JP4  124.46,5.08 0 top
JP5  6.35,5.08 0 top
JP6  17.78,93.98 0 top
JP11  119.38,95.25 0 top
L1  49,55 270 top
LED3  59.06,88.09 0 top
LED4  73.03,88.09 0 top
LED6  42.55,88.09 0 top
M1  125.35,75.36 0 top
Q1  7,84 180 top
R1  77.5,80.5 0 top
R2  81.5,81 0 top
R3  73.5,80 0 top
R4  64.5,80.5 0 top
R5  60.5,80.5 0 top
R6  55.73,80.43 0 top
R7  47,80.5 0 top
R8  42.5,80.5 0 top
R9  36.8,80.43 0 top
R10  18,74.5 180 top
R11  9,62.5 180 top
R12  13.5,63.5 0 top
R13  133,66 0 top
R14  141.5,27 0 top
R15  142,24 0 top
R16  142.5,20.5 0 top
R17  141,17 0 top
R18  143,14.5 0 top
R19  140.5,18.5 0 top
R20  140.5,69 0 top
R21  129.24,64.83 0 top
R22  136.5,16.5 0 top
R23  140,73.5 0 top
R24  134,76 0 top
R25  128.5,70 0 top
R26  123.85,70.05 0 top
STM32  59.58,61.23 0 top
SW1  16.51,15.24 0 top
SW2  34.29,15.24 0 top
SW3  51.76,15.24 0 top
SW4  69.85,15.24 0 top
SW5  88.94,15.24 0 top

### Tracks (layer width: path | path; a pad name or v marks a point on that pad's centre or on a via)
3.3V  (via drill 0.61)  (16 unrouted)
  Top 0.254: STM32.48 67.56,64.98 C17.1 70.89,65.89 v71,66 | STM32.64 55.83,69.21 C18.1 54.92,72.42 v55,72.5 | STM32.19 56.83,52.55 arc-90 C19.1 57,51.96 v57,50.5 | STM32.32 63.33,53.25 C16.1 64,52.1 v64,50.5 | v50.5,52.5 50.4,52.5 L1.2
  pour Route15: -1.27,100.33 160.02,100.33 160.02,0 -1.27,0
3.3V_A
  Top 0.254: STM32.13 51.33,58.98 C7.2 C27.2 47,58.1 L1.1
AGND  (via drill 0.61)
  Top 0.254: 50.87,59.48 STM32.12 | 50.87,59.48 C7.1 50.5,61 v50,61.5 | 50.87,59.48 47.37,59.48 C27.1 33.5,59.85 R10.1
BOOT0  (1 unrouted)
D1  (1 unrouted)
GND  (via drill 0.61)  (35 unrouted)
  Top 0.254: STM32.47 68.47,64.48 C17.2 | STM32.63 56.33,70.12 C18.2 | STM32.18 56.33,53.75 C19.2 | STM32.31 62.83,52.63 C16.2
  other vias: 25.5,53 54,50.5 61.5,50.5 70.5,64 57.5,72
  pour Route2: -1.27,100.33 160.02,100.33 160.02,0 -1.27,0
I2C_SCL  (1 unrouted)
I2C_SDA  (1 unrouted)
KB1  (1 unrouted)
KB2  (1 unrouted)
KB3  (1 unrouted)
KG1  (1 unrouted)
KG2  (1 unrouted)
KG3  (1 unrouted)
KR1  (1 unrouted)
KR2  (1 unrouted)
KR3  (1 unrouted)
LED+  (7 unrouted)
MIC_IN  (1 unrouted)
N$1  (2 unrouted)
N$2  (1 unrouted)
N$3  (2 unrouted)
N$4  (1 unrouted)
N$5  (4 unrouted)
N$6  (2 unrouted)
N$8  (4 unrouted)
N$9  (1 unrouted)
N$10  (3 unrouted)
N$11  (3 unrouted)
N$12  (2 unrouted)
N$17  (2 unrouted)
N$18  (2 unrouted)
N$23  (2 unrouted)
N$25  (1 unrouted)
N$28  (3 unrouted)
N$12312  (1 unrouted)
NRST  (1 unrouted)
PA2  (1 unrouted)
PA3  (1 unrouted)
PA9  (1 unrouted)
PB0  (1 unrouted)
PB1  (1 unrouted)
PB8  (1 unrouted)
PB9  (1 unrouted)
PB12  (2 unrouted)
PB13  (2 unrouted)
PB14  (1 unrouted)
PB15  (1 unrouted)
PC0  (2 unrouted)
PC1  (2 unrouted)
PC2  (2 unrouted)
PC3  (1 unrouted)
PC4  (1 unrouted)
PWM_OUT  (1 unrouted)
SPK1  (3 unrouted)
SPK2  (1 unrouted)
SWDCLK  (1 unrouted)
SWDIO  (1 unrouted)
VIN  (2 unrouted)
VIN_SW  (3 unrouted)